# EAGLE design RCDudelTiny (EAGLE 6.6.0)
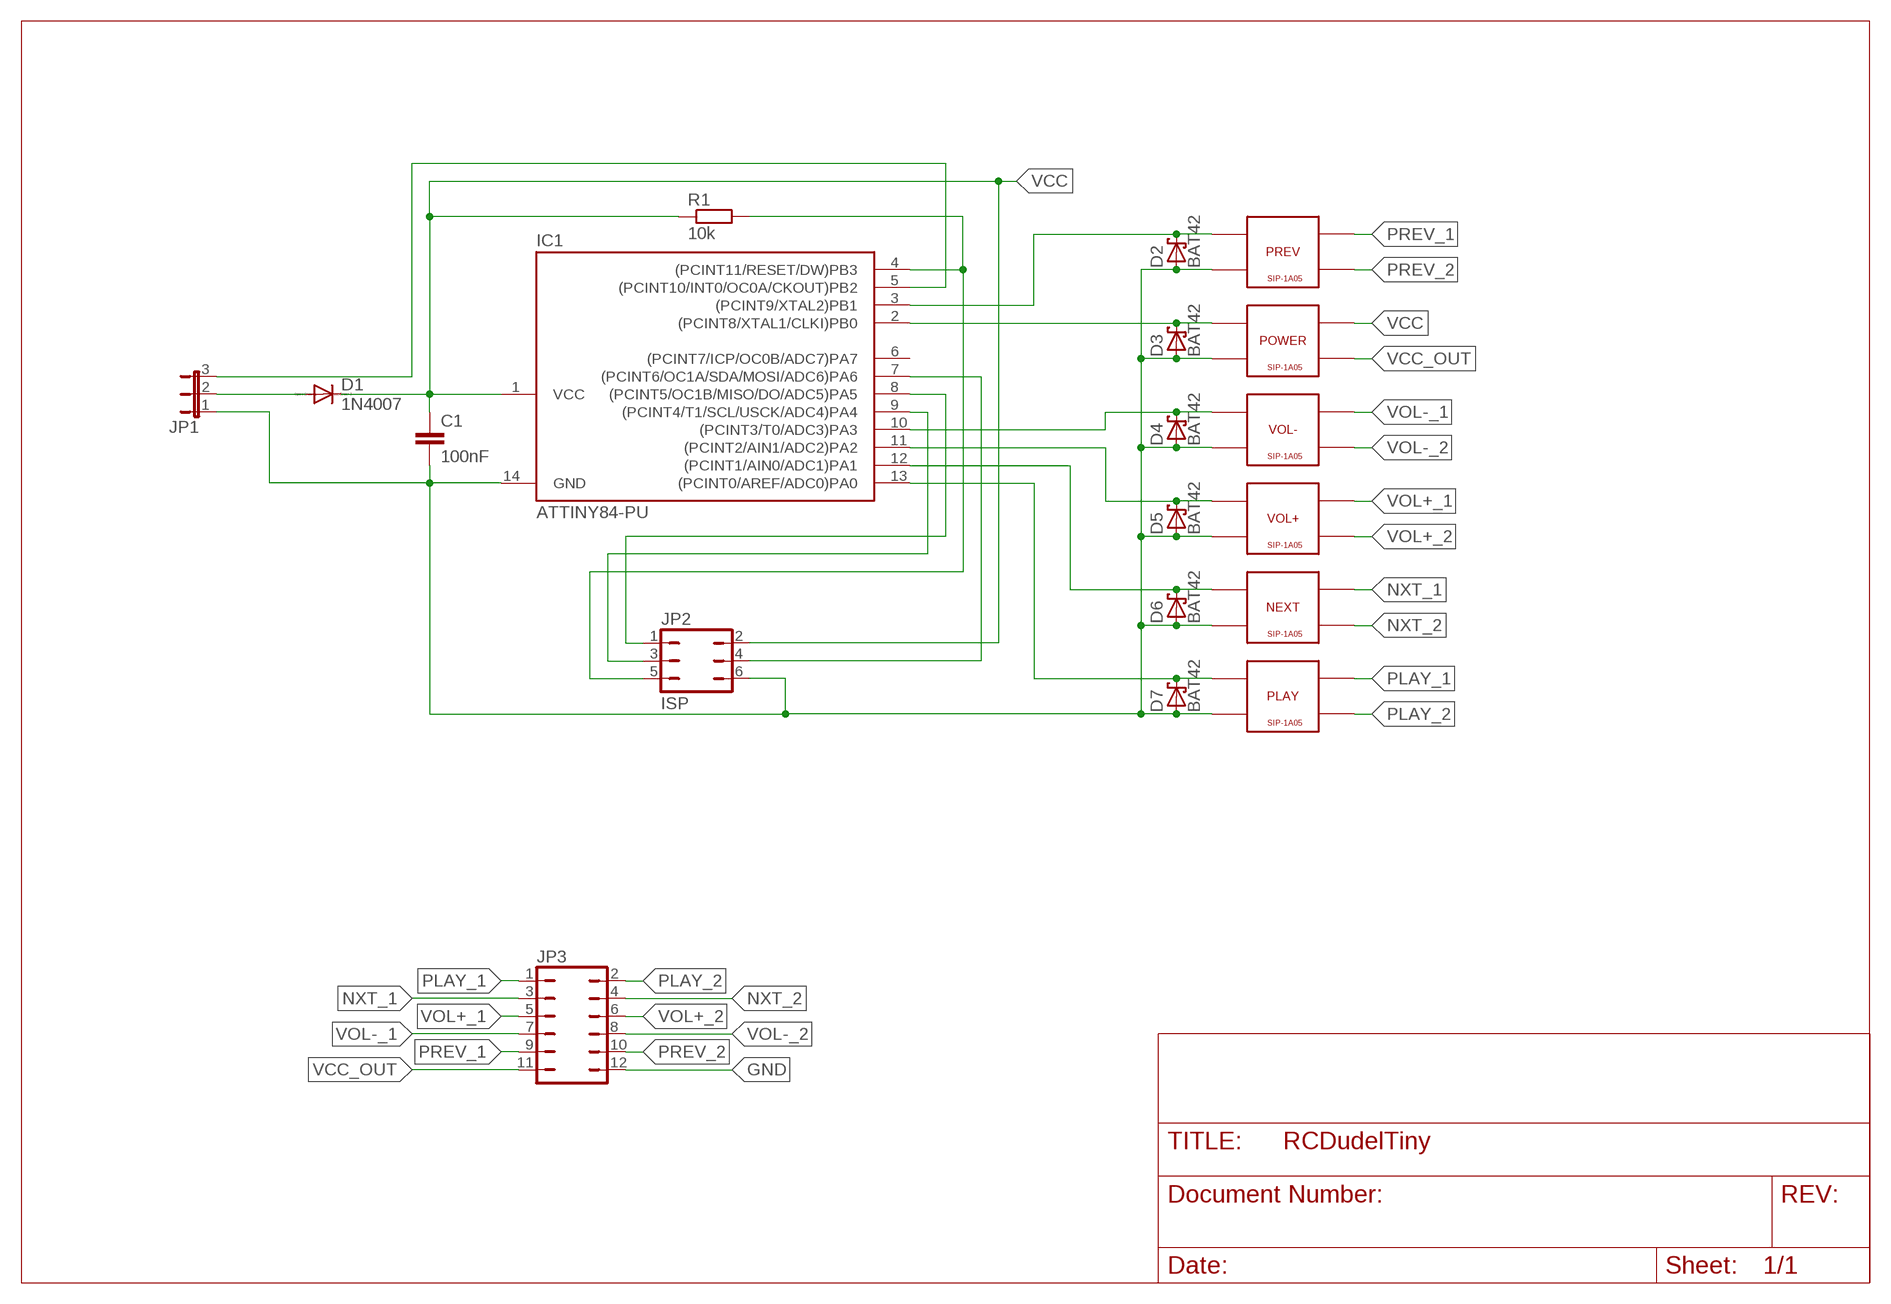
[diagram p0: schematic, sheet 1]

## Parts
C1  100nF  C-EU025-025X050  [C025-025X050]
D1  1N4007  1N4004  [DO41-10]
D2  BAT42  [DO35-10]
D3  BAT42  [DO35-10]
D4  BAT42  [DO35-10]
D5  BAT42  [DO35-10]
D6  BAT42  [DO35-10]
D7  BAT42  [DO35-10]
IC1  ATTINY84-PU  TINY24/44/84-PU  [DIL14]
JP1  JP2EJP2_OHNE_TEXT  [JP2]
JP2  ISP  JP3Q  [JP3Q]
JP3  JP6Q  [JP6Q]
NEXT  SIP1A05  [SIP1A05]
PLAY  SIP1A05  [SIP1A05]
POWER  SIP1A05  [SIP1A05]
PREV  SIP1A05  [SIP1A05]
R1  10k  R-EU_0207/7  [0207/7]
VOL+  SIP1A05  [SIP1A05]
VOL-  SIP1A05  [SIP1A05]

## Nets
GND: C1.2 D2.A D3.A D4.A D5.A D6.A D7.A IC1.14(GND) JP1.1 JP2.6 JP3.12 NEXT.SP2 PLAY.SP2 POWER.SP2 PREV.SP2 VOL+.SP2 VOL-.SP2
N$1: D1.A JP1.2
N$3: IC1.5((PCINT10/INT0/OC0A/CKOUT)PB2) JP1.3
N$4: IC1.4((PCINT11/RESET/DW)PB3) JP2.5 R1.2
N$5: IC1.8((PCINT5/OC1B/MISO/DO/ADC5)PA5) JP2.1
N$6: IC1.9((PCINT4/T1/SCL/USCK/ADC4)PA4) JP2.3
N$7: IC1.7((PCINT6/OC1A/SDA/MOSI/ADC6)PA6) JP2.4
N$8: D2.C IC1.3((PCINT9/XTAL2)PB1) PREV.SP1
N$10: D3.C IC1.2((PCINT8/XTAL1/CLKI)PB0) POWER.SP1
N$12: D4.C IC1.10((PCINT3/T0/ADC3)PA3) VOL-.SP1
N$14: D5.C IC1.11((PCINT2/AIN1/ADC2)PA2) VOL+.SP1
N$16: D6.C IC1.12((PCINT1/AIN0/ADC1)PA1) NEXT.SP1
N$18: D7.C IC1.13((PCINT0/AREF/ADC0)PA0) PLAY.SP1
NXT_1: JP3.3 NEXT.K1
NXT_2: JP3.4 NEXT.K2
PLAY_1: JP3.1 PLAY.K1
PLAY_2: JP3.2 PLAY.K2
PREV_1: JP3.9 PREV.K1
PREV_2: JP3.10 PREV.K2
VCC: C1.1 D1.C IC1.1(VCC) JP2.2 POWER.K1 R1.1
VCC_OUT: JP3.11 POWER.K2
VOL+_1: JP3.5 VOL+.K1
VOL+_2: JP3.6 VOL+.K2
VOL-_1: JP3.7 VOL-.K1
VOL-_2: JP3.8 VOL-.K2
Unconnected: IC1.6((PCINT7/ICP/OC0B/ADC7)PA7)

## Library data of the parts
C1 = rcl:C-EU: CAPACITOR, European symbol
D1 = diode:1N4004: DIODE general purpose rectifier, 1 A
D2-D7 = diode:BAT42: DIODE barrier diode
IC1 = avr-7:TINY24/44/84
JP1 = marco:JP2E: JUMPER
JP2 = jumper:JP3Q: JUMPER
JP3 = jumper:JP6Q: JUMPER
NEXT PLAY POWER PREV VOL+ VOL- = marco:SIP1A05
R1 = rcl:R-EU_: RESISTOR, European symbol

## Board
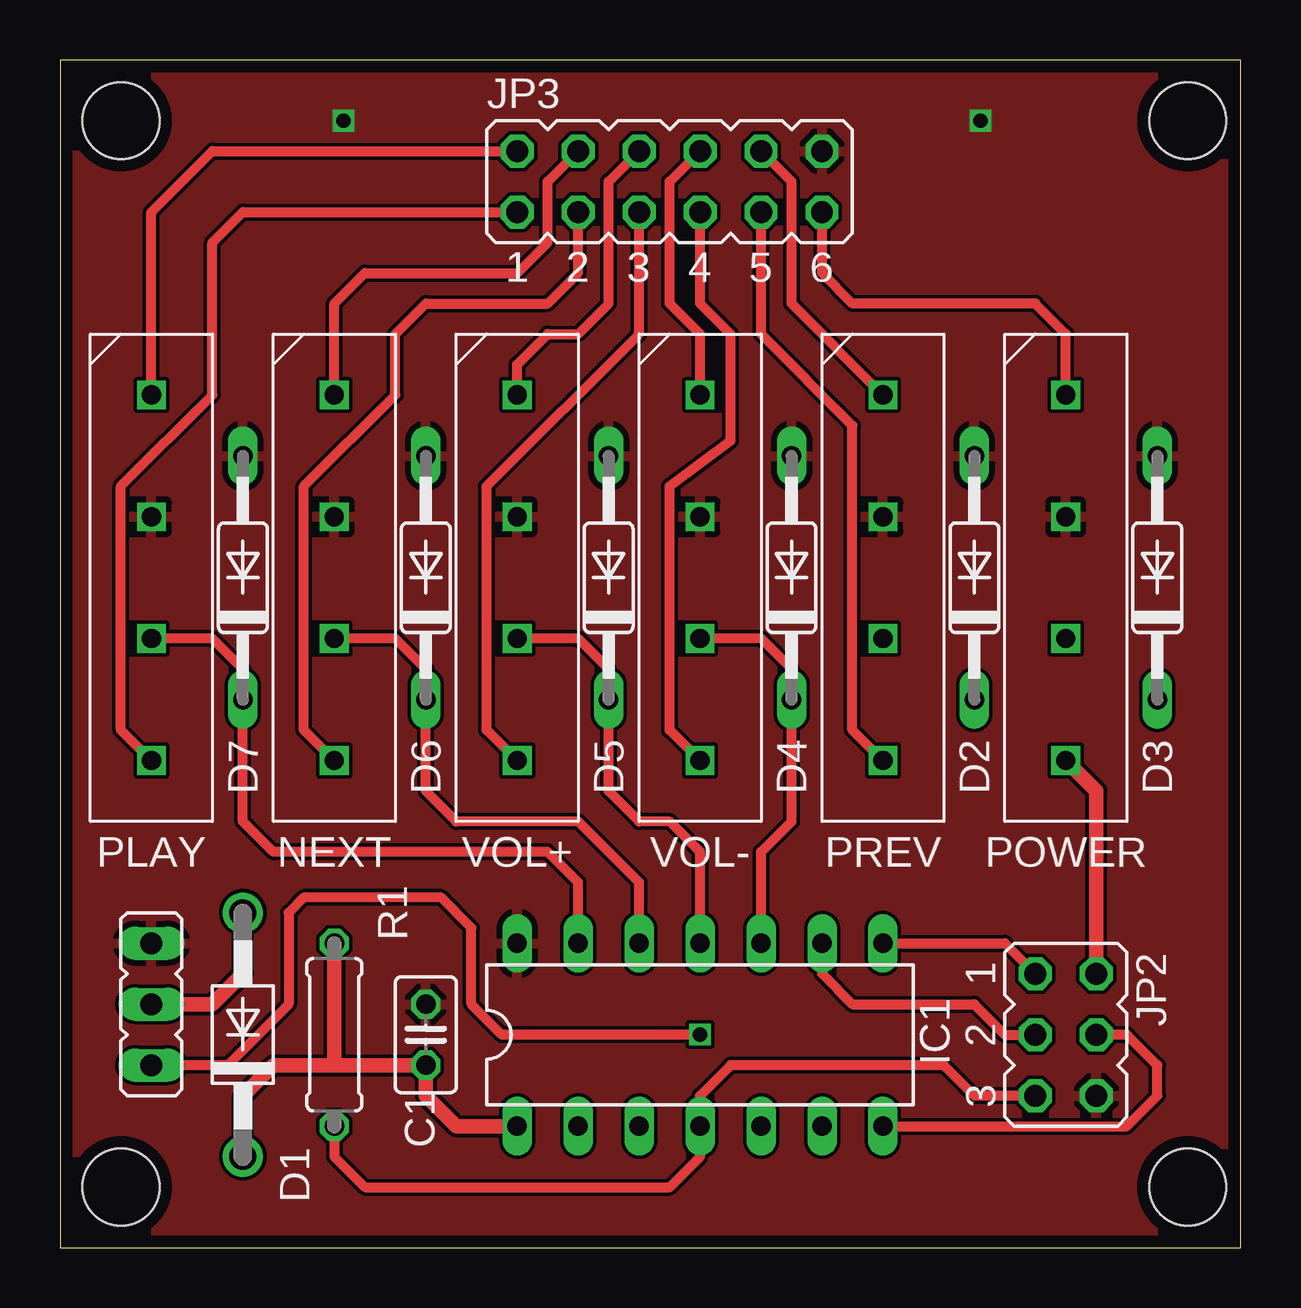
[diagram p1: board, top side]
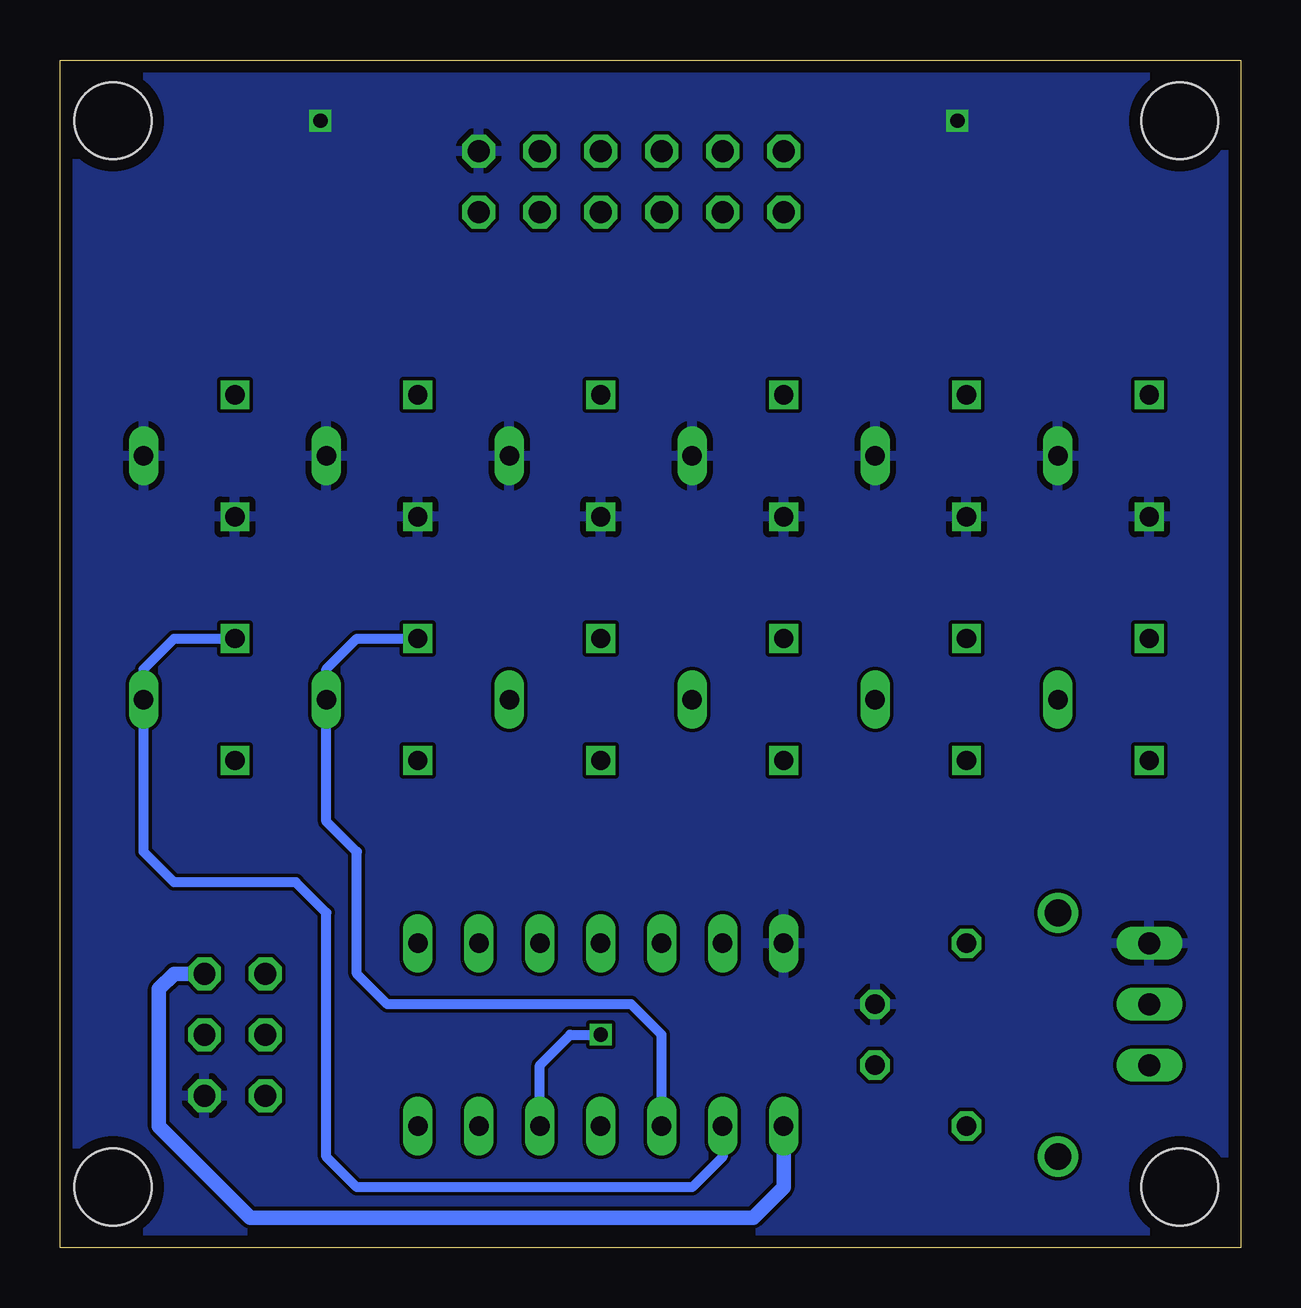
[diagram p2: board, bottom side, seen from below]

Size 49.2 x 49.52 mm. Coordinates in mm from the lower left corner, seen from the top.
Outline: 0,0 49.2,0 49.2,49.52 0,49.52 0,0
Copper layers (1*16): Top 0.035mm / dielectric 1.6mm / Bottom 0.035mm
Design rules "Elecrow_2-layer_PCB_eagle_rule": minimum track width 6mil, minimum drill 12mil, track to track 6mil, track to pad 6mil, pad to pad 6mil, via to via 8mil, smd to smd 0mil, copper to edge 20mil, drill to drill 10mil, minimum pad ring 6mil, minimum via ring 6mil, stop-mask expansion 0mil, vias tented up to drill 100mil, thermal gap 10mil
Holes 3.2 mm at 2.54,46.99 46.99,46.99 46.99,2.54 2.54,2.54

### Footprints (pad centres in the part's own frame; a part is rotated, then mirrored left to right if it is on the bottom)
C025-025X050 = drill 0.813 octagon: 1 -1.27,0; 2 1.27,0
DO41-10 = drill 1.118: A 5.08,0; C -5.08,0
DO35-10 = drill 0.813 long: A 5.08,0; C -5.08,0
DIL14 = drill 0.813 long: 1 -7.62,-3.81; 2 -5.08,-3.81; 3 -2.54,-3.81; 4 0,-3.81; 5 2.54,-3.81; 6 5.08,-3.81; 7 7.62,-3.81; 8 7.62,3.81; 9 5.08,3.81; 10 2.54,3.81; 11 0,3.81; 12 -2.54,3.81; 13 -5.08,3.81; 14 -7.62,3.81
JP2 = drill 0.914 long: 1 -2.54,0; 2 0,0; 3 2.54,0
JP3Q = drill 0.914 octagon: 1 -2.54,-1.27; 2 -2.54,1.27; 3 0,-1.27; 4 0,1.27; 5 2.54,-1.27; 6 2.54,1.27
JP6Q = drill 0.914 octagon: 1 -6.35,-1.27; 2 -6.35,1.27; 3 -3.81,-1.27; 4 -3.81,1.27; 5 -1.27,-1.27; 6 -1.27,1.27; 7 1.27,-1.27; 8 1.27,1.27; 9 3.81,-1.27; 10 3.81,1.27; 11 6.35,-1.27; 12 6.35,1.27
SIP1A05 = drill 0.8 square: K1 -6.35,0; K2 8.89,0; SP1 -1.27,0; SP2 3.81,0
0207/7 = drill 0.813 octagon: 1 -3.81,0; 2 3.81,0

### Placement (x,y rotation side)
C1  15.24,8.89 90 top
D1  7.62,8.89 90 top
D2  38.1,27.94 90 top
D3  45.72,27.94 90 top
D4  30.48,27.94 90 top
D5  22.86,27.94 90 top
D6  15.24,27.94 90 top
D7  7.62,27.94 90 top
IC1  26.67,8.89 0 top
JP1  3.81,10.16 270 top
JP2  41.91,8.89 270 top
JP3  25.4,44.45 0 top
NEXT  11.43,26.67 90 top
PLAY  3.81,26.67 90 top
POWER  41.91,26.67 90 top
PREV  34.29,26.67 90 top
R1  11.43,8.89 270 top
VOL+  19.05,26.67 90 top
VOL-  26.67,26.67 90 top

### Tracks (layer width: path | path; a pad name or v marks a point on that pad's centre or on a via)
GND  (via drill 0.6)
  other vias: 11.81,46.99 38.35,46.99
  pour Bottom: 0,49.53 49.53,49.53 49.53,0 0,0
  pour Top: 0,49.53 49.53,49.53 49.53,0 0,0
N$1
  Top 0.61: JP1.2 6.35,10.16 7.62,11.43 D1.A
N$3  (via drill 0.6)
  Top 0.406: v26.67,8.89 18.41,8.89 17.14,10.16 17.14,13.34 15.88,14.61 10.16,14.61 9.53,13.97 9.53,10.16 6.99,7.62 JP1.3
  Bottom 0.406: IC1.5 29.21,7.62 27.94,8.89 v26.67,8.89
N$4
  Top 0.406: R1.2 11.43,3.81 12.7,2.54 25.4,2.54 26.67,3.81 IC1.4 26.67,6.35 27.94,7.62 36.83,7.62 38.1,6.35 JP2.5
N$5
  Top 0.406: IC1.8 39.37,12.7 JP2.1
N$6
  Top 0.406: IC1.9 31.75,11.43 33.02,10.16 38.1,10.16 39.37,8.89 JP2.3
N$7
  Top 0.406: IC1.7 44.45,5.08 45.72,6.35 45.72,7.62 44.45,8.89 JP2.4
N$8
  Bottom 0.406: IC1.3 24.13,8.89 25.4,10.16 35.56,10.16 36.83,11.43 36.83,16.51 38.1,17.78 D2.C 38.1,24.13 36.83,25.4 PREV.SP1
N$10
  Bottom 0.406: IC1.2 21.59,3.81 22.86,2.54 36.83,2.54 38.1,3.81 38.1,13.97 39.37,15.24 44.45,15.24 45.72,16.51 D3.C 45.72,24.13 44.45,25.4 POWER.SP1
N$12
  Top 0.406: IC1.10 29.21,16.51 30.48,17.78 D4.C 30.48,24.13 29.21,25.4 VOL-.SP1
N$14
  Top 0.406: IC1.11 26.67,16.51 25.4,17.78 24.13,17.78 22.86,19.05 D5.C 22.86,24.13 21.59,25.4 VOL+.SP1
N$16
  Top 0.406: IC1.12 24.13,15.24 21.59,17.78 16.51,17.78 15.24,19.05 D6.C 15.24,24.13 13.97,25.4 NEXT.SP1
N$18
  Top 0.406: IC1.13 21.59,15.24 20.32,16.51 8.89,16.51 7.62,17.78 D7.C 7.62,24.13 6.35,25.4 PLAY.SP1
NXT_1
  Top 0.406: NEXT.K1 10.16,21.59 10.16,31.75 13.97,35.56 13.97,38.1 15.24,39.37 20.32,39.37 21.59,40.64 JP3.3
NXT_2
  Top 0.406: NEXT.K2 11.43,39.37 12.7,40.64 19.05,40.64 20.32,41.91 20.32,44.45 JP3.4
PLAY_1
  Top 0.406: PLAY.K1 2.54,21.59 2.54,31.75 6.35,35.56 6.35,41.91 7.62,43.18 JP3.1
PLAY_2
  Top 0.406: PLAY.K2 3.81,43.18 6.35,45.72 JP3.2
PREV_1
  Top 0.406: PREV.K1 33.02,21.59 33.02,34.29 29.21,38.1 JP3.9
PREV_2
  Top 0.406: PREV.K2 30.48,39.37 30.48,44.45 JP3.10
VCC
  Top 0.61: D1.C 7.62,6.35 8.89,7.62 11.43,7.62 | 11.43,7.62 C1.1 15.24,6.35 16.51,5.08 IC1.1 | R1.1 11.43,7.62 | JP2.2 43.18,19.05 POWER.K1
  Bottom 0.61: IC1.1 19.05,2.54 20.32,1.27 41.27,1.27 45.09,5.08 45.09,10.79 44.45,11.43 JP2.2
VCC_OUT
  Top 0.406: POWER.K2 41.91,38.1 40.64,39.37 33.02,39.37 31.75,40.64 JP3.11
VOL+_1
  Top 0.406: VOL+.K1 17.78,21.59 17.78,31.75 24.13,38.1 JP3.5
VOL+_2
  Top 0.406: VOL+.K2 19.05,36.83 20.32,38.1 21.59,38.1 22.86,39.37 22.86,44.45 JP3.6
VOL-_1
  Top 0.406: VOL-.K1 25.4,21.59 25.4,31.75 27.94,33.66 27.94,38.1 26.67,39.37 JP3.7
VOL-_2
  Top 0.406: VOL-.K2 26.67,38.1 25.4,39.37 25.4,44.45 JP3.8

### Text on the board
tDocu: by / M.Stoffers | RCDudel / Tiny | GND VCC SIG